# EasyEDA schematic 1059-Codarl-m_2021-05-06.json
TITLE: 1059 Codarl-m; REV: 4.20; Date: 2021-05-06; Sheet: 1/1; Company: Titan Defence Systems
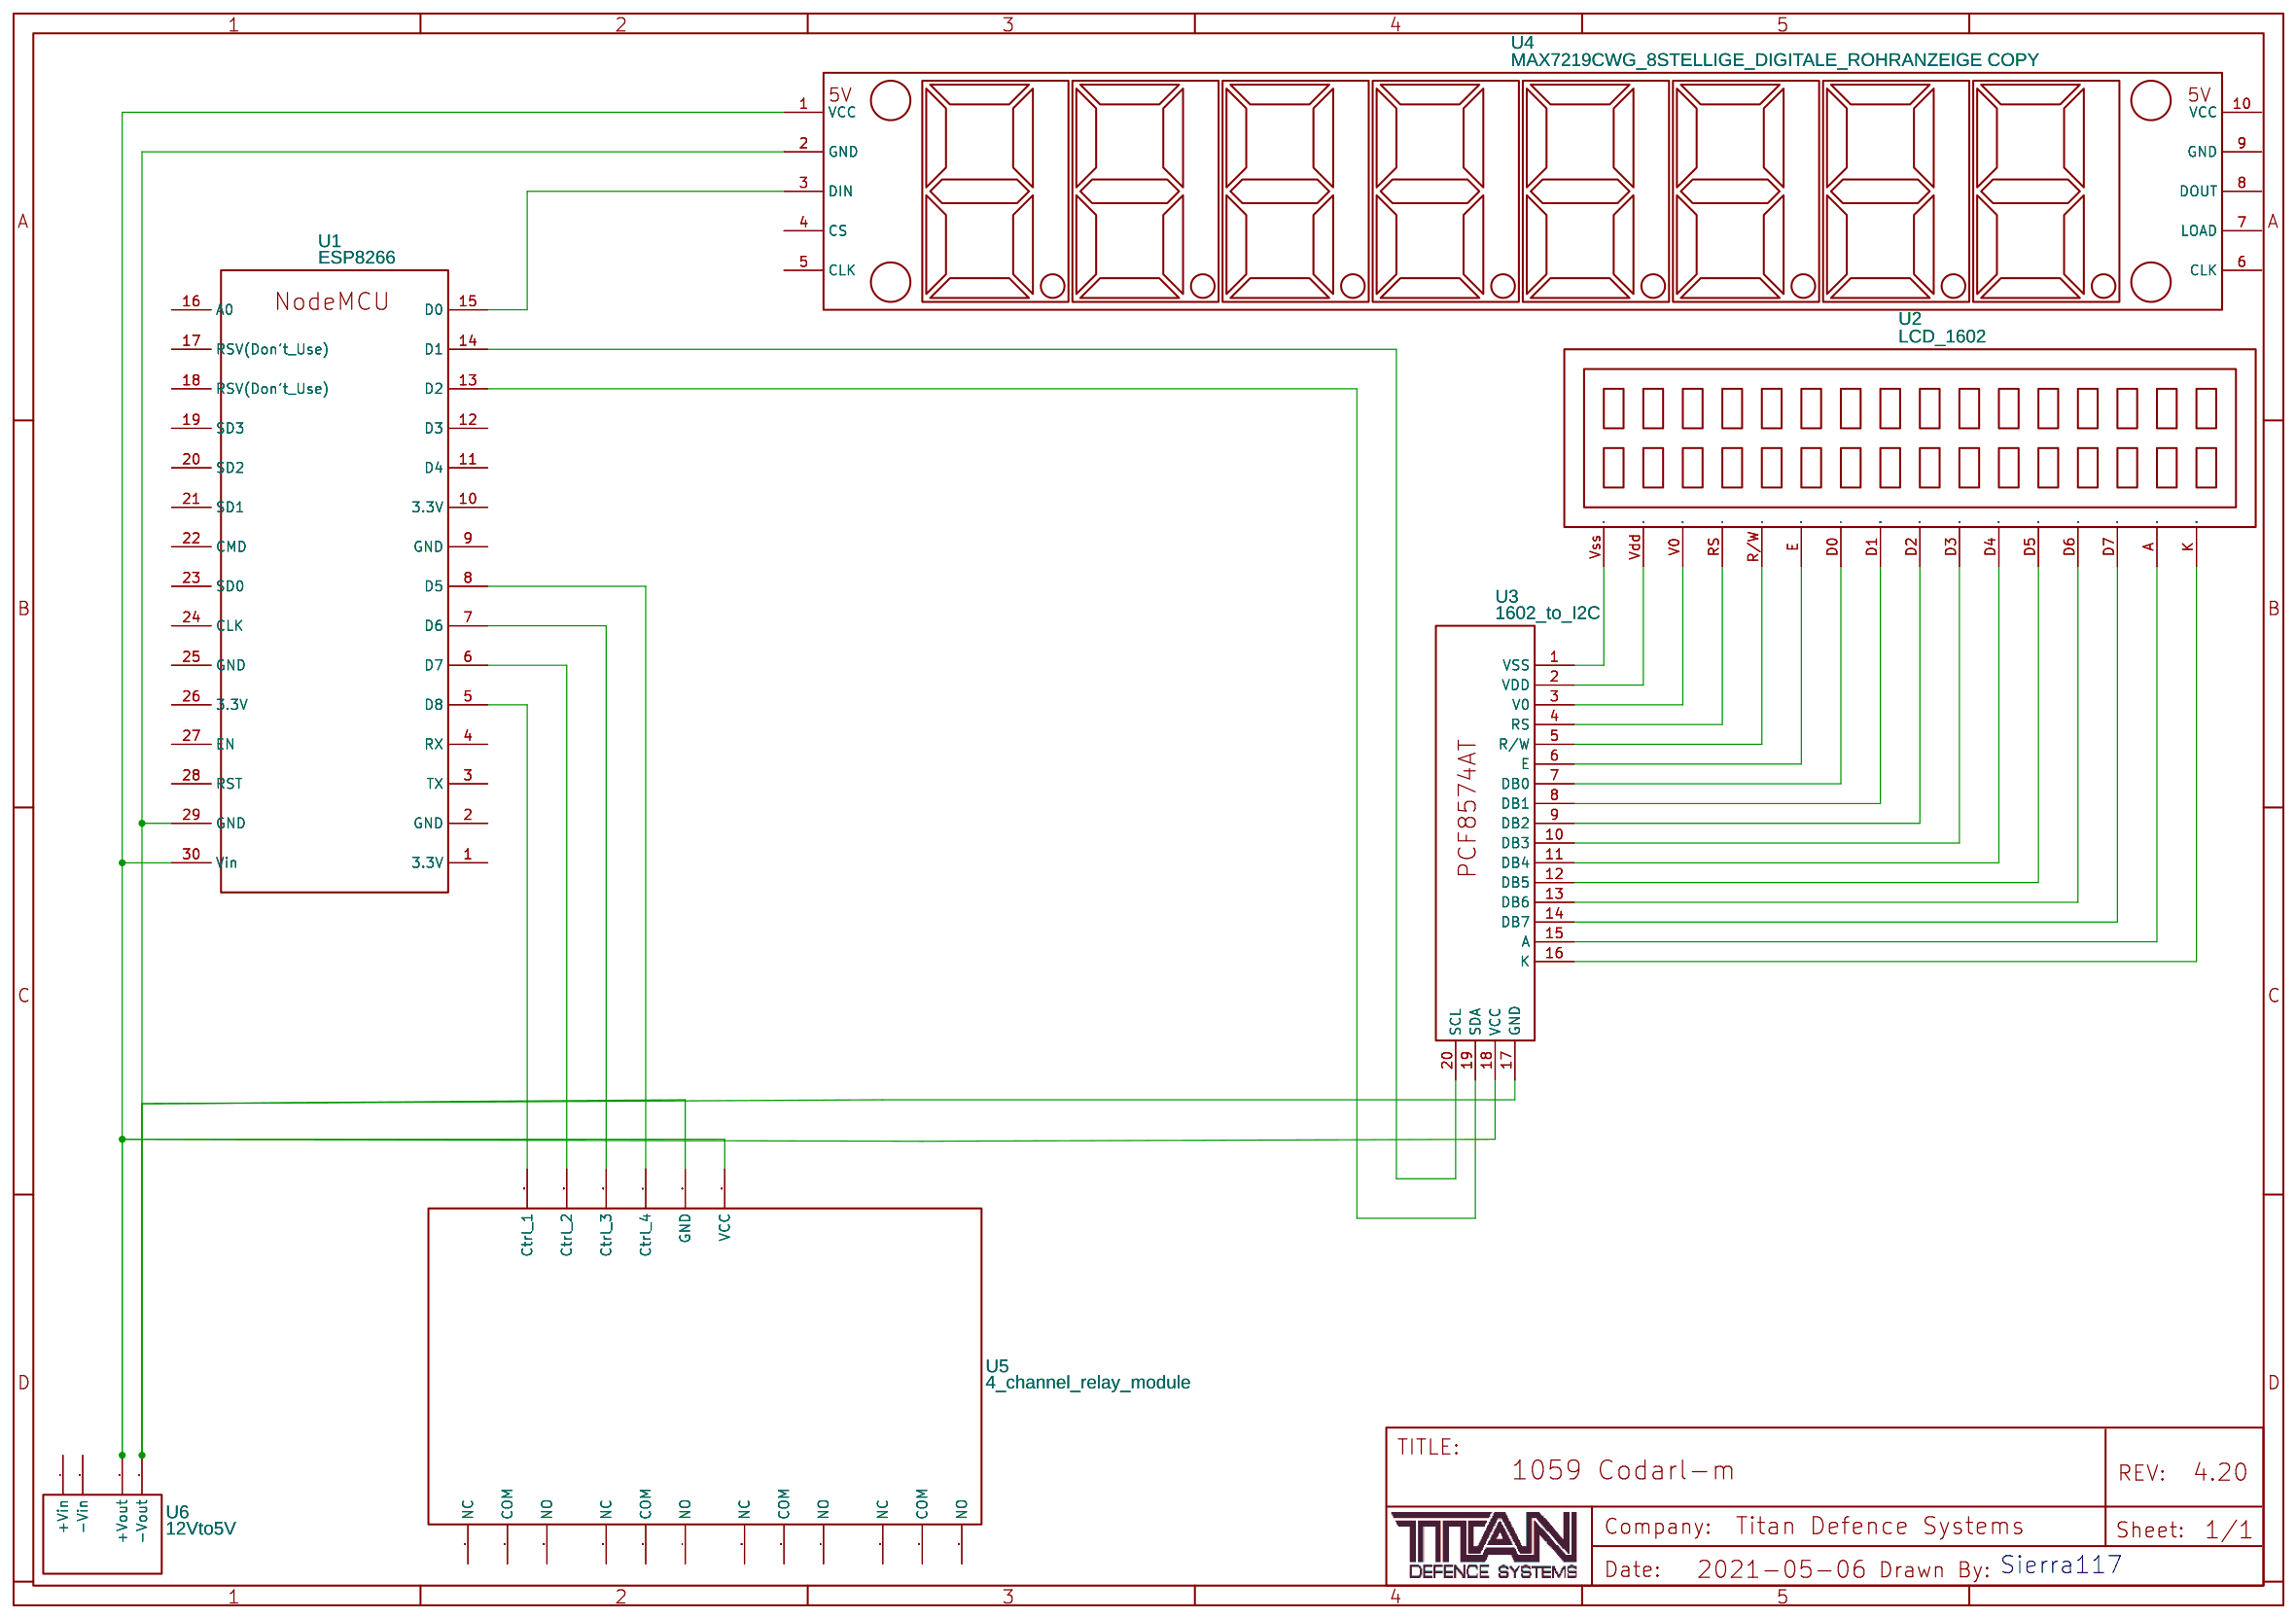
[diagram p0: schematic sheet]

## Parts
U1  ESP8266  [ESP12E_DEVKIT-V1]
U2  LCD_1602
U3  1602_to_I2C
U4  MAX7219CWG_8STELLIGE_DIGITALE_ROHRANZEIGE COPY
U5  4_channel_relay_module
U6  12Vto5V

## Library data of the parts
U1 = ESP8266: Contributor: micky0867; sourceId: OGtr1ZXUS
U2 = LCD_1602: catid: 20; Contributor: Tadeáš Zajíček (q)
U3 = 1602_to_I2C: catid: 20; Contributor: kiseev.nikolay; Manufacturer Part: Converter 1602-to-I2C; sim: true
U4 = MAX7219CWG_8STELLIGE_DIGITALE_ROHRANZEIGE COPY: catid: 20; link: https://pdf1.alldatasheet.com/datasheet-pdf/view/227795/MAXIM/MAX7219CWG.html; Contributor: DynamicSun; Manufacturer Part: MAX7219CWG; sim: true
U5 = 4_channel_relay_module: Contributor: Guest
U6 = 12Vto5V: catid: 20; Contributor: adrielgff

## Nets
Net-(U1-5): U1.5(D8) U1.6(D7) U5.19(Ctrl 1)
Net-(U1-7): U1.7(D6) U5.18(Ctrl 3)
Net-(U1-8): U1.8(D5) U5.17(Ctrl 4)
Net-(U1-13): U1.13(D2) U3.19(SDA)
Net-(U1-14): U1.14(D1) U3.20(SCL)
Net-(U1-15): U1.15(D0) U4.3(DIN)
Net-(U1-29): U1.29(GND) U3.17(GND) U4.2(GND) U5.16(GND) U6.4(-Vout)
Net-(U1-30): U1.30(Vin) U3.18(VCC) U4.1(VCC) U5.15(VCC) U6.3(+Vout)
Net-(U2-A): U2.A(15) U3.15(A)
Net-(U2-D0): U2.D0(7) U3.7(DB0)
Net-(U2-D1): U2.D1(8) U3.8(DB1)
Net-(U2-D2): U2.D2(9) U3.9(DB2)
Net-(U2-D3): U2.D3(10) U3.10(DB3)
Net-(U2-D4): U2.D4(11) U3.11(DB4)
Net-(U2-D5): U2.D5(12) U3.12(DB5)
Net-(U2-D6): U2.D6(13) U3.13(DB6)
Net-(U2-D7): U2.D7(14) U3.14(DB7)
Net-(U2-E): U2.E(6) U3.6(E)
Net-(U2-K): U2.K(16) U3.16(K)
Net-(U2-R/W): U2.R/W(5) U3.5(R/W)
Net-(U2-RS): U2.RS(4) U3.4(RS)
Net-(U2-V0): U2.V0(3) U3.3(V0)
Net-(U2-Vdd): U2.Vdd(2) U3.2(VDD)
Net-(U2-Vss): U2.Vss(1) U3.1(VSS)

Not connected (* = marked no-connect by the designer): U1 1(3.3V) 2(GND) 3(TX) 4(RX) 9(GND) 10(3.3V) 11(D4) 12(D3) 16(A0) 17(RSV(Don't Use)) 18(RSV(Don't Use)) 19(SD3) 20(SD2) 21(SD1) 22(CMD) 23(SD0) 24(CLK) 25(GND) 26(3.3V) 27(EN) 28(RST); U4 4(CS) 5(CLK) 6(CLK) 7(LOAD) 8(DOUT) 9(GND) 10(VCC); U5 2(COM) 3(NC) 4(NO) 5(COM) 6(NC) 7(NO) 8(COM) 9(NC) 10(NO) 11(COM) 12(NC) NO; U6 1(+Vin) 2(-Vin)

## Notes on the sheet
- Sierra117
